# EAGLE design driver motor ver 2 (EAGLE 7.2.0)
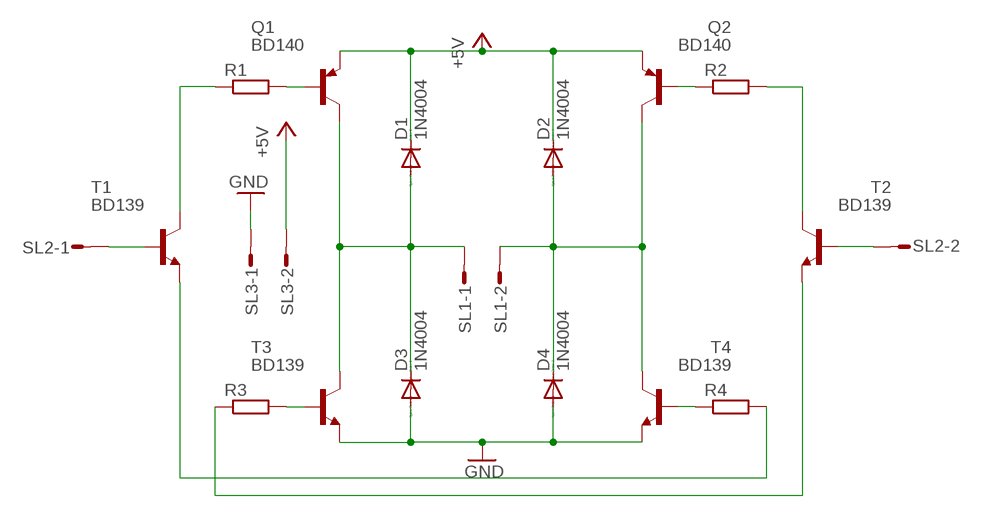
[diagram p0: schematic, sheet 1]

## Parts
D1  1N4004  [DO41-10]
D2  1N4004  [DO41-10]
D3  1N4004  [DO41-10]
D4  1N4004  [DO41-10]
Q1  BD140  [TO126]
Q2  BD140  [TO126]
R1  R-EU_0204/5  [0204/5]
R2  R-EU_0204/5  [0204/5]
R3  R-EU_0204/5  [0204/5]
R4  R-EU_0204/5  [0204/5]
SL1  M02S  [02P]
SL2  M02S  [02P]
SL3  M02S  [02P]
T1  BD139  [TO126]
T2  BD139  [TO126]
T3  BD139  [TO126]
T4  BD139  [TO126]

## Nets
+5V: D1.C D2.C Q1.1(E) Q2.1(E) SL3.2
GND: D3.A D4.A SL3.1 T3.1(E) T4.1(E)
N$1: Q1.3(B) R1.2
N$2: Q2.3(B) R2.1
N$3: R3.2 T3.3(B)
N$4: SL2.1 T1.3(B)
N$5: SL2.2 T2.3(B)
N$6: R1.1 T1.2(C)
N$8: D1.A D3.C Q1.2(C) SL1.1 T3.2(C)
N$9: D2.A D4.C Q2.2(C) SL1.2 T4.2(C)
N$10: R4.2 T1.1(E)
N$12: R4.1 T4.3(B)
N$13: R3.1 T2.1(E)
N$14: R2.2 T2.2(C)

## Library data of the parts
D1-D4 = diode:1N4004: DIODE general purpose rectifier, 1 A
Q1 Q2 = transistor-pnp:BD140: PNP Transistor
R1-R4 = resistor:R-EU_: RESISTOR, European symbol
SL1-SL3 = con-amp-quick:M02S: AMP QUICK CONNECTOR; OC_FARNELL: unknown; OC_NEWARK: unknown
T1-T4 = transistor:BD139: NPN TRANSISTOR

## Board
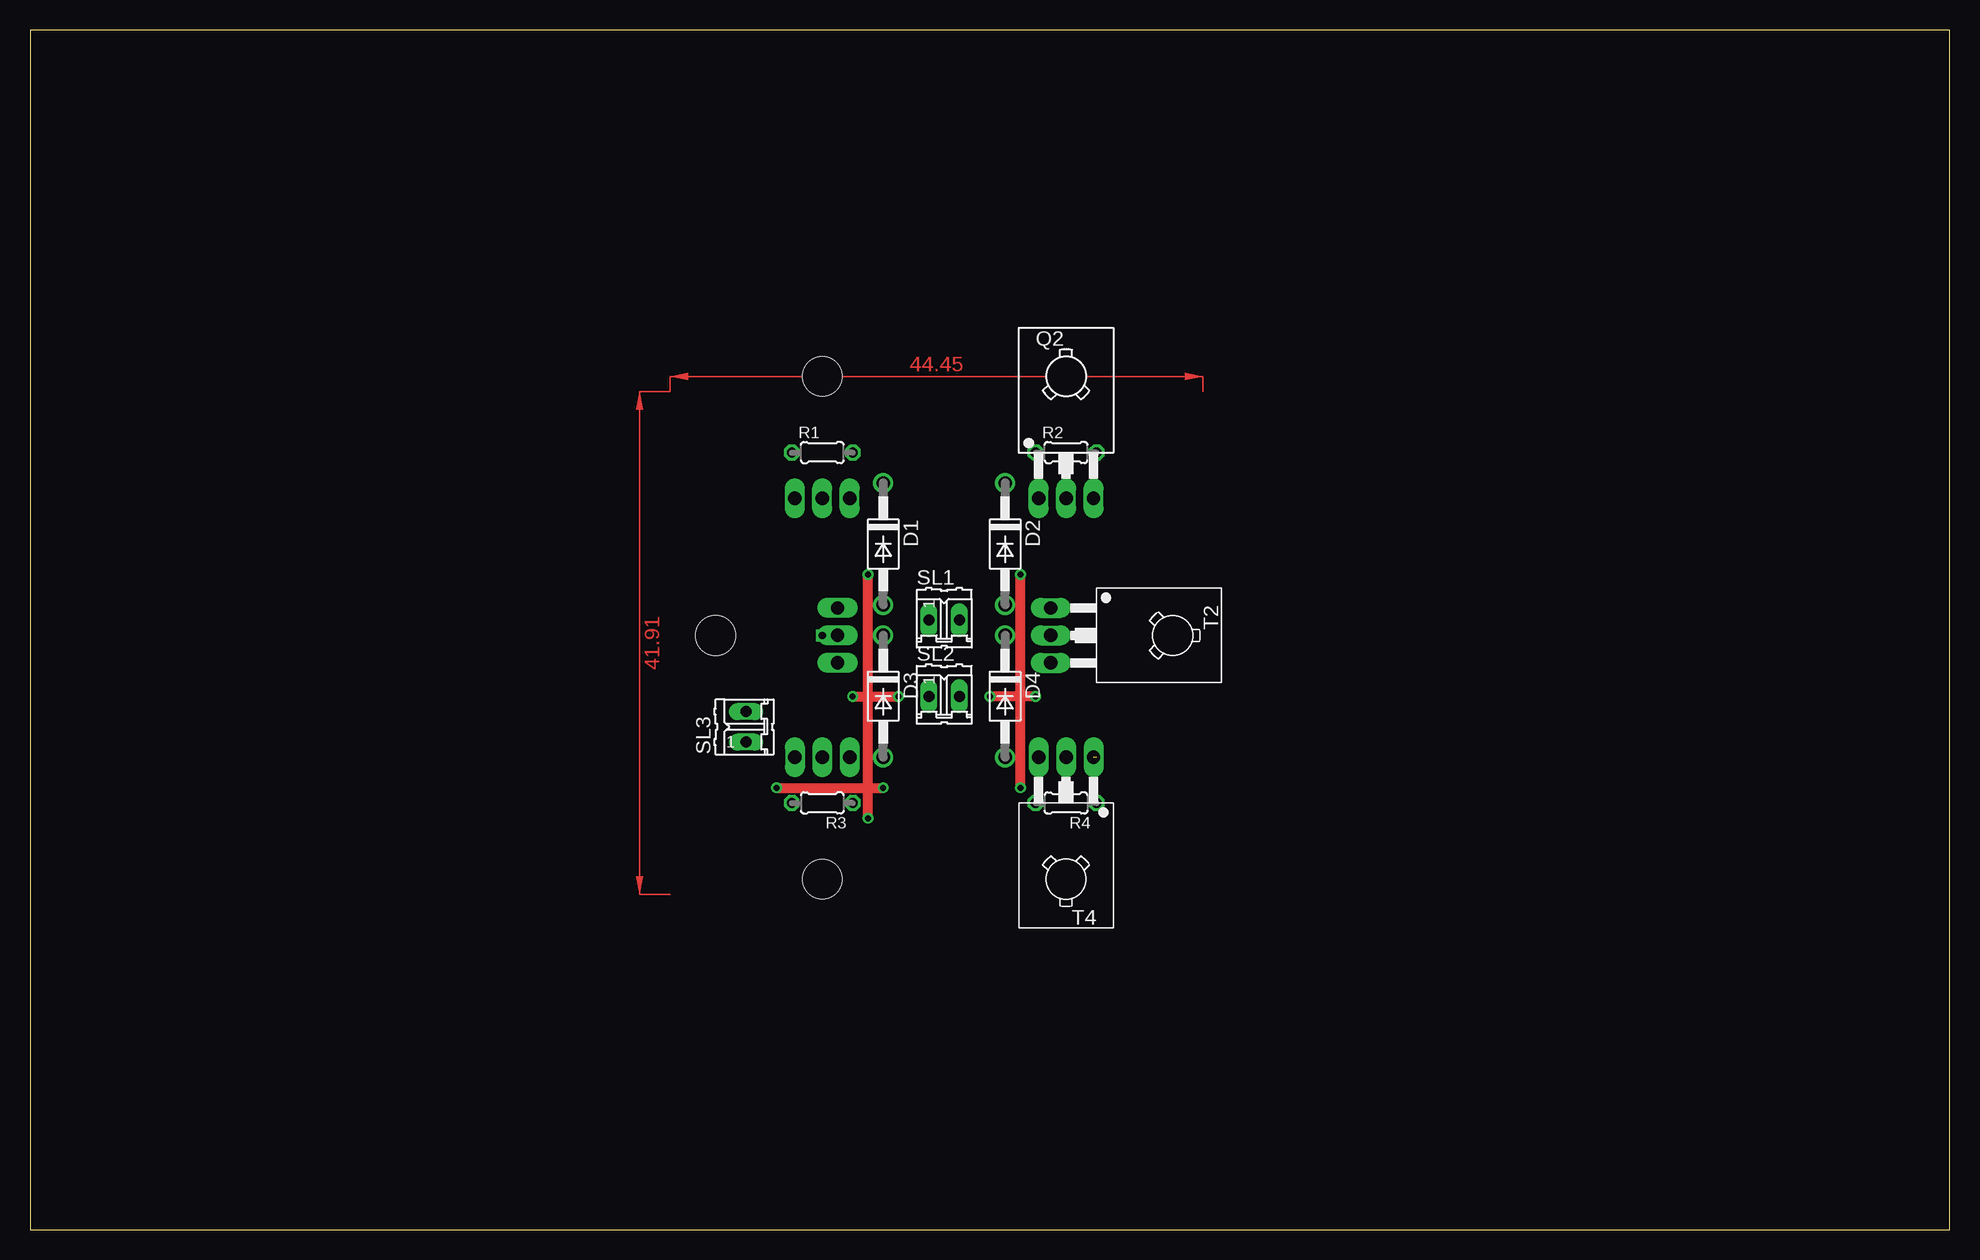
[diagram p1: board, top side]
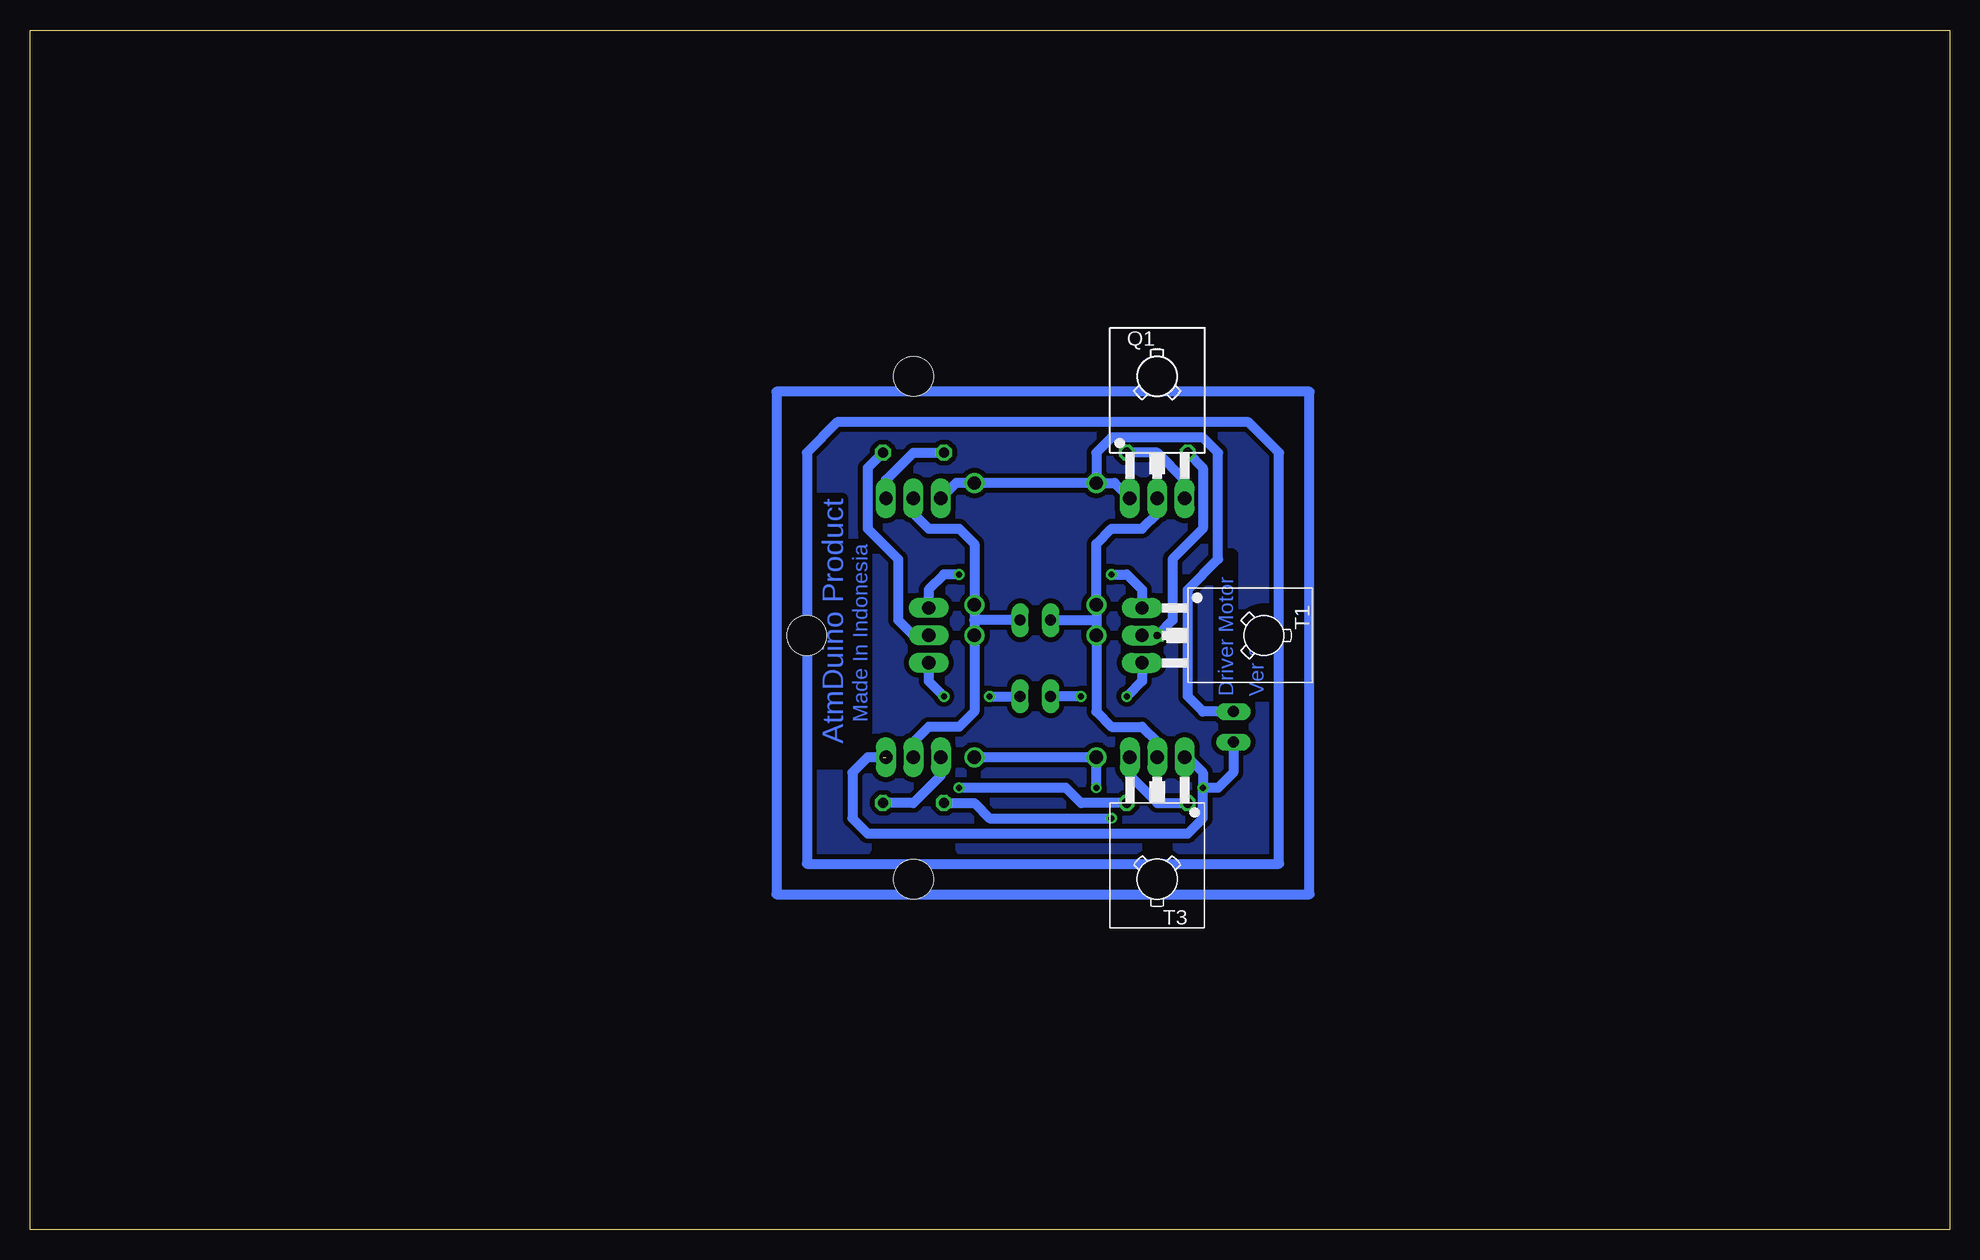
[diagram p2: board, bottom side, seen from below]

Size 160 x 100 mm. Coordinates in mm from the lower left corner, seen from the top.
Outline: 0,0 160,0 160,100 0,100 0,0
Copper layers (1*16): Top 0.035mm / dielectric 1.5mm / Bottom 0.035mm
Design rules "default": minimum track width 10mil, minimum drill 24mil, track to track 8mil, track to pad 8mil, pad to pad 8mil, via to via 8mil, smd to smd 8mil, copper to edge 40mil, drill to drill 8mil, minimum pad ring 10mil, minimum via ring 8mil, stop-mask expansion 4mil, vias tented up to drill 0mil, thermal gap 10mil

### Footprints (pad centres in the part's own frame; a part is rotated, then mirrored left to right if it is on the bottom)
DO41-10 = drill 1.118: A 5.08,0; C -5.08,0
TO126 = drill 1.118 long: 1 -2.286,-5.08; 2 0,-5.08; 3 2.286,-5.08 | hole 3.302: 0,5.08
0204/5 = drill 0.813 octagon: 1 -2.54,0; 2 2.54,0
02P = drill 0.914 long: 1 -1.27,0; 2 1.27,0

### Placement (x,y rotation side)
D1  71.12,57.15 270 top
D2  81.28,57.15 270 top
D3  71.12,44.45 270 top
D4  81.28,44.45 270 top
Q1  66.04,66.04 0 bottom
Q2  86.36,66.04 0 top
R1  66.04,64.77 0 top
R2  86.36,64.77 0 top
R3  66.04,35.56 180 top
R4  86.36,35.56 180 top
SL1  76.2,50.8 0 top
SL2  76.2,44.45 0 top
SL3  59.69,41.91 90 top
T1  62.23,49.53 270 bottom
T2  90.17,49.53 270 top
T3  66.04,34.29 180 bottom
T4  86.36,34.29 180 top

### Tracks (layer width: path | path; a pad name or v marks a point on that pad's centre or on a via)
+5V
  Bottom 0.813: D1.C D2.C 82.8,62.23 Q2.1 | D1.C 69.6,62.23 Q1.1 68.58,60.96 | SL3.2 62.23,43.18 63.5,44.45 63.5,53.34 60.96,55.88 60.96,64.77 62.23,66.04 69.85,66.04 71.12,64.77 D1.C
GND  (via drill 0.5)  (1 unrouted)
  Top 0.813: v62.23,36.83 v71.12,36.83
  Bottom 0.813: D4.A D3.A v71.12,36.83 | SL3.1 59.69,38.1 60.96,36.83 v62.23,36.83 | v62.23,36.83 62.23,34.29 63.5,33.02 90.17,33.02 91.44,34.29 91.44,38.1 90.17,39.37 88.9,39.37 | T3.1 63.5,39.37 62.23,38.1 v62.23,36.83
N$1
  Bottom 0.813: Q1.3 63.75,62.48 66.04,64.77 R1.2
N$2
  Bottom 0.813: Q2.3 88.65,62.48 86.36,64.77 R2.1
N$3
  Bottom 0.813: T3.3 68.33,37.85 66.04,35.56 R3.2
N$4  (via drill 0.5)
  Top 0.813: v68.58,44.45 v72.39,44.45
  Bottom 0.813: T1.3 67.31,45.72 v68.58,44.45 | v72.39,44.45 SL2.1
N$5  (via drill 0.5)
  Top 0.813: v83.82,44.45 v80.01,44.45
  Bottom 0.813: T2.3 85.09,45.72 v83.82,44.45 | v80.01,44.45 SL2.2
N$6  (via drill 0.6)
  Bottom 0.813: R1.1 62.23,63.5 62.23,58.42 64.77,55.88 64.77,50.8 v66.04,49.53 T1.2
N$7
  pour Bottom (isolate 0.406, rank 3): 58.42,67.31 92.71,67.31 95.25,64.77 95.25,30.48 58.42,30.48 57.15,30.48 55.88,30.48 55.88,64.77
N$8
  Bottom 0.813: 71.12,50.8 D1.A 71.12,57.15 69.85,58.42 67.31,58.42 66.04,59.69 Q1.2 | 71.12,50.8 D3.C 71.12,43.18 69.85,41.91 67.31,41.91 66.04,40.64 T3.2 | SL1.1 71.12,50.8
N$9
  Bottom 0.813: 81.28,50.8 D2.A 81.28,57.15 82.55,58.42 85.09,58.42 86.36,59.69 Q2.2 | 81.28,50.8 D4.C 81.28,43.18 82.55,41.91 85.09,41.91 86.36,40.64 T4.2 | SL1.2 81.28,50.8
N$10  (via drill 0.5)
  Top 0.813: v69.85,34.29 v69.85,54.61
  Bottom 0.813: R4.2 81.28,35.56 80.01,34.29 v69.85,34.29 | v69.85,54.61 68.58,54.61 67.31,53.34 T1.1
N$11
  Bottom 0.813: 58.42,67.31 92.71,67.31 95.25,64.77 95.25,30.48 55.88,30.48 55.88,64.77 58.42,67.31
N$12
  Bottom 0.813: T4.3 84.07,37.85 86.36,35.56 R4.1
N$13  (via drill 0.5)
  Top 0.813: v82.55,36.83 v82.55,54.61
  Bottom 0.813: R3.1 72.39,35.56 73.66,36.83 v82.55,36.83 | v82.55,54.61 83.82,54.61 85.09,53.34 T2.1
N$14
  Bottom 0.813: R2.2 90.17,63.5 90.17,58.42 87.63,55.88 87.63,50.8 86.36,49.53 T2.2
N$15
  Bottom 0.813: 97.79,69.85 97.79,27.94 53.34,27.94 53.34,69.85 97.79,69.85
(copper drawn outside any net)
  shapes: Top area x2

### Text on the board
Bottom: AtmDuino Product | Made In Indonesia | Ver 2.0 | Driver Motor